# EAGLE design gain_mute (EAGLE 6.5.0)
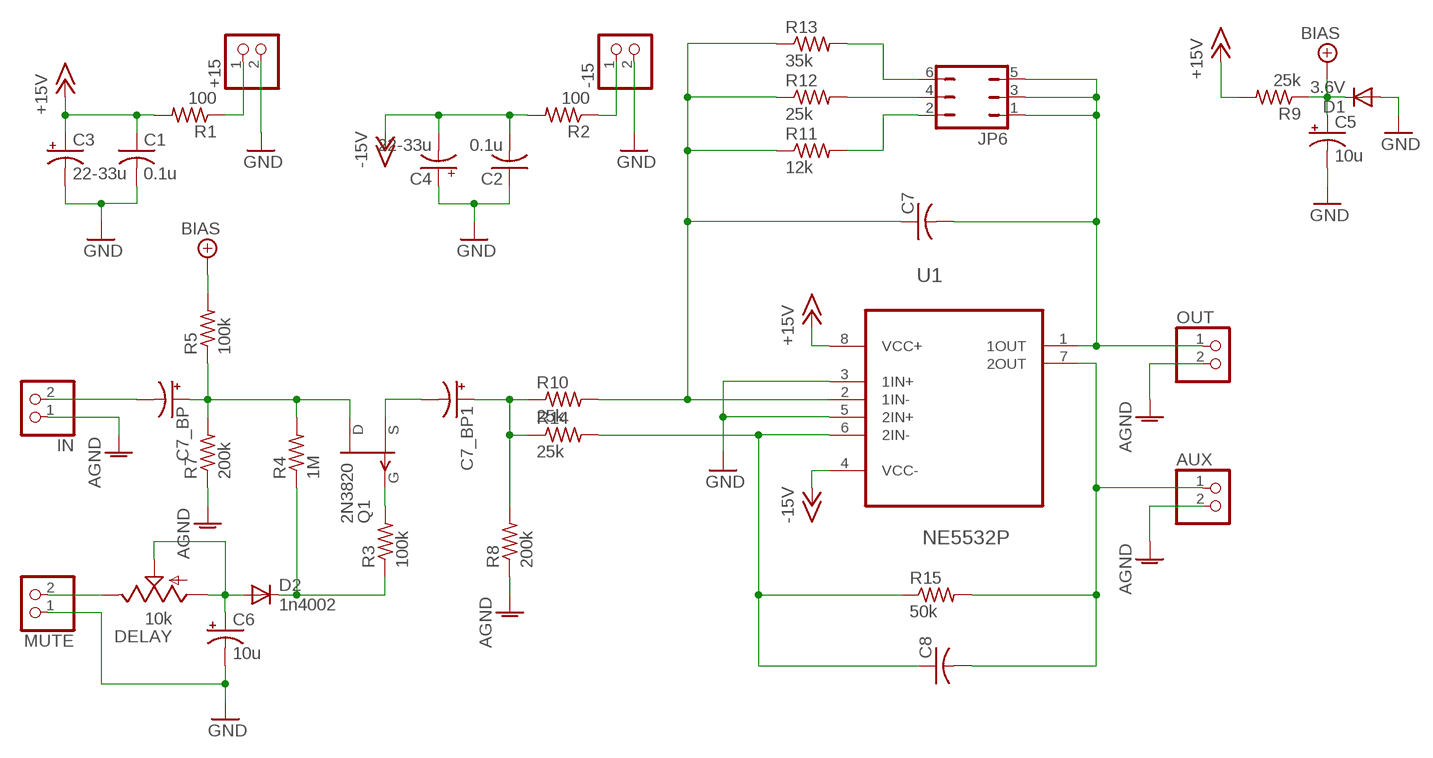
[diagram p0: schematic, sheet 1]

## Parts
+15  PINHD-1X2  [1X02]
-15  PINHD-1X2  [1X02]
AUX  PINHD-1X2  [1X02]
C1  0.1u  C-USC1206  [C1206]
C2  0.1u  C-USC1206  [C1206]
C3  22-33u  CPOL-USE2-5  [E2-5]
C4  22-33u  CPOL-USE2-5  [E2-5]
C5  10u  CPOL-USE2-5  [E2-5]
C6  10u  CPOL-USE2-5  [E2-5]
C7  C-US050-024X044  [C050-024X044]
C7_BP  CPOL-USE2.5-7  [E2,5-7]
C7_BP1  CPOL-USE2.5-7  [E2,5-7]
C8  C-US050-024X044  [C050-024X044]
D1  3.6V  DIODE-SOD123  [SOD123]
D2  1n4002  DIODE-SOD123  [SOD123]
DELAY  10k  TRIM_US-3223J  [3223J]
IN  PINHD-1X2  [1X02]
JP6  JP3Q  [JP3Q]
MUTE  PINHD-1X2  [1X02]
OUT  PINHD-1X2  [1X02]
Q1  2N3820  [TO92]
R1  100  R-US_0207/7  [0207/7]
R2  100  R-US_0207/7  [0207/7]
R3  100k  R-US_R1206  [R1206]
R4  1M  R-US_R1206  [R1206]
R5  100k  R-US_R1206  [R1206]
R7  200k  R-US_R1206  [R1206]
R8  200k  R-US_R1206  [R1206]
R9  25k  R-US_R1206  [R1206]
R10  25k  R-US_0207/7  [0207/7]
R11  12k  R-US_0207/7  [0207/7]
R12  25k  R-US_0207/7  [0207/7]
R13  35k  R-US_0207/7  [0207/7]
R14  25k  R-US_0207/7  [0207/7]
R15  50k  R-US_0207/7  [0207/7]
U1  NE5532P  [DIP254P762X508-8]

## Nets
+5V/2: C5.+ D1.C R5.2 R9.1 ; supply symbol labelled BIAS
+15V: C1.1 C3.+ R1.2 R9.2 U1.8(VCC+)
-15V: C2.2 C4.- R2.2 U1.4(VCC-)
AGND: AUX.2 IN.1 OUT.2 R7.1 R8.1
GND: +15.2 -15.2 C1.2 C2.1 C3.- C4.+ C5.- C6.- D1.A MUTE.1 U1.3(1IN+) U1.5(2IN+)
N$1: +15.1 R1.1
N$2: C7_BP.- IN.2
N$3: DELAY.3(E) MUTE.2
N$4: -15.1 R2.1
N$5: C7_BP.+ Q1.3(D) R4.2 R5.1 R7.2
N$6: C6.+ D2.A DELAY.1(A) DELAY.2(S)
N$7: D2.C R3.1 R4.1
N$8: Q1.2(G) R3.2
N$9: C7_BP1.- Q1.1(S)
N$10: C7_BP1.+ R8.2 R10.1 R14.1
N$11: C7.1 R10.2 R11.1 R12.1 R13.1 U1.2(1IN-)
N$12: JP6.4 R12.2
N$13: JP6.6 R13.2
N$14: JP6.2 R11.2
N$15: C7.2 JP6.1 JP6.3 JP6.5 OUT.1 U1.1(1OUT)
N$17: AUX.1 C8.2 R15.2 U1.7(2OUT)
N$18: C8.1 R14.2 R15.1 U1.6(2IN-)

## Library data of the parts
+15 -15 AUX IN MUTE OUT = pinhead:PINHD-1X2: PIN HEADER
C1 C2 C7 C8 = rcl:C-US: CAPACITOR, American symbol
C3-C6 C7_BP C7_BP1 = rcl:CPOL-US: POLARIZED CAPACITOR, American symbol
D1 D2 = diode:DIODE-: DIODE
DELAY = pot:TRIM_US-: POTENTIOMETER
JP6 = jumper:JP3Q: JUMPER
Q1 = transistor-fet:2N3820: P-Channel Junction FET Source: http://www.fairchildsemi.com/ds/2N/2N3820.pdf
R1-R5 R7-R15 = rcl:R-US_: RESISTOR, American symbol
U1 = ne5532:NE5532P: OPERATIONAL AMPLIFIERS; MPN: NE5532P; OC_FARNELL: 1106092; OC_NEWARK: 59K8751; PACKAGE: PDIP; SUPPLIER: Texas Instruments

## Board
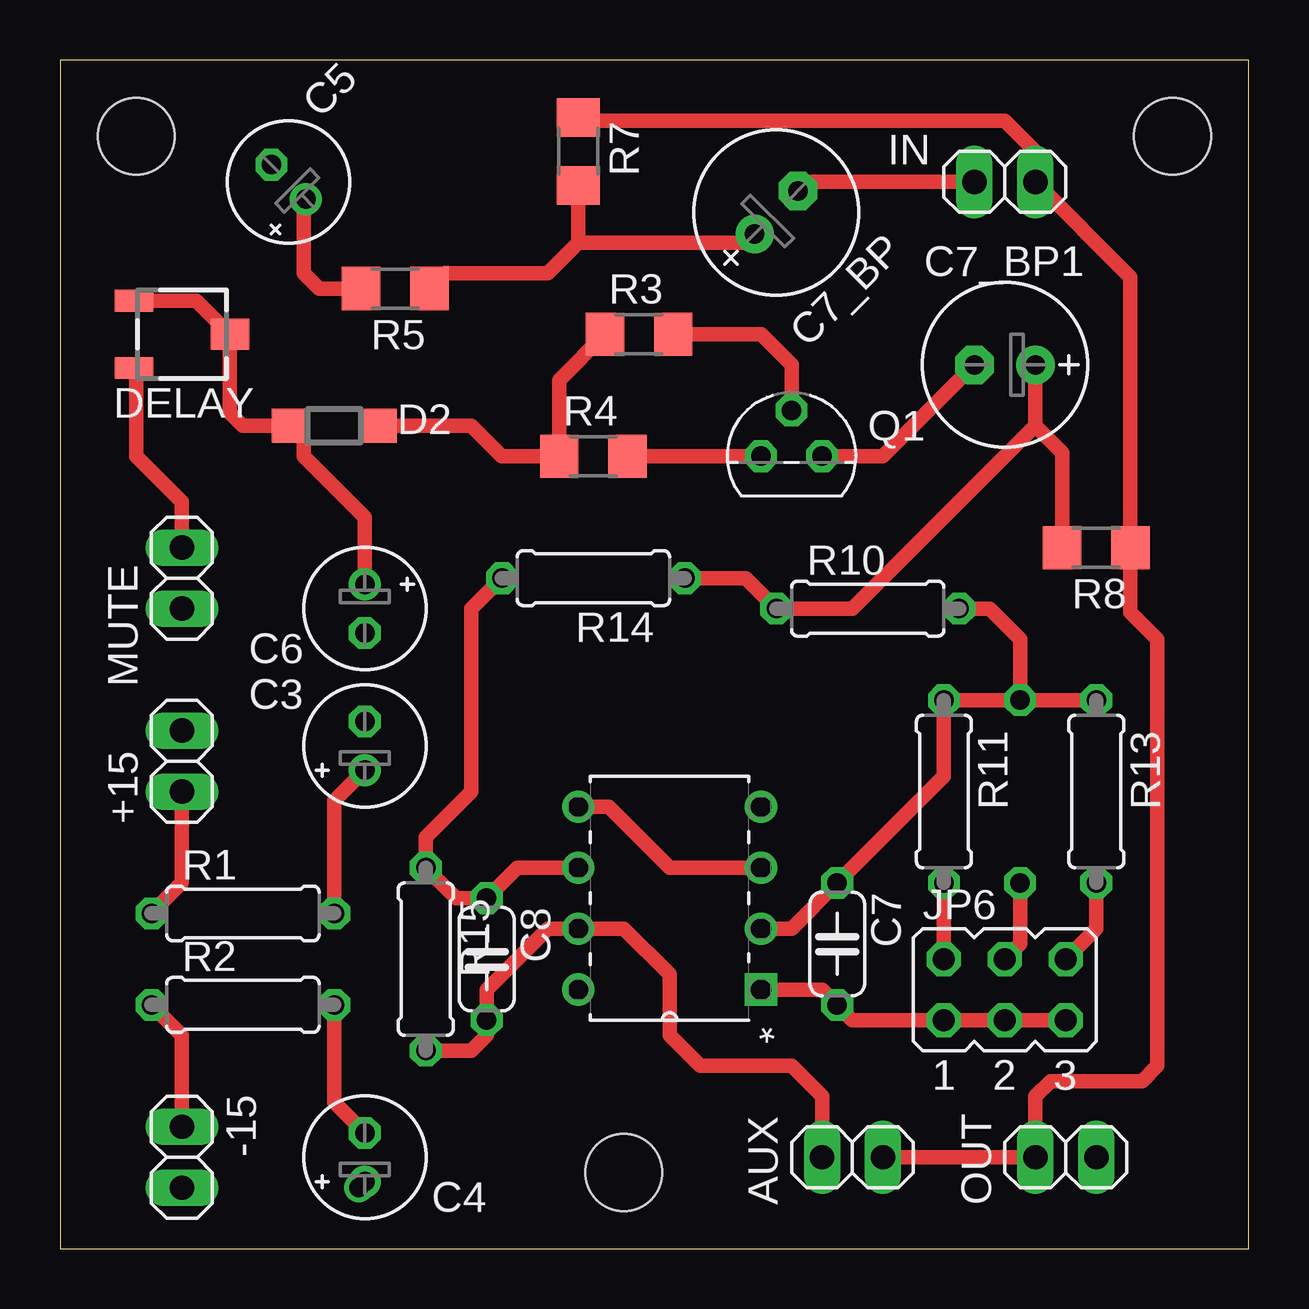
[diagram p1: board, top side]
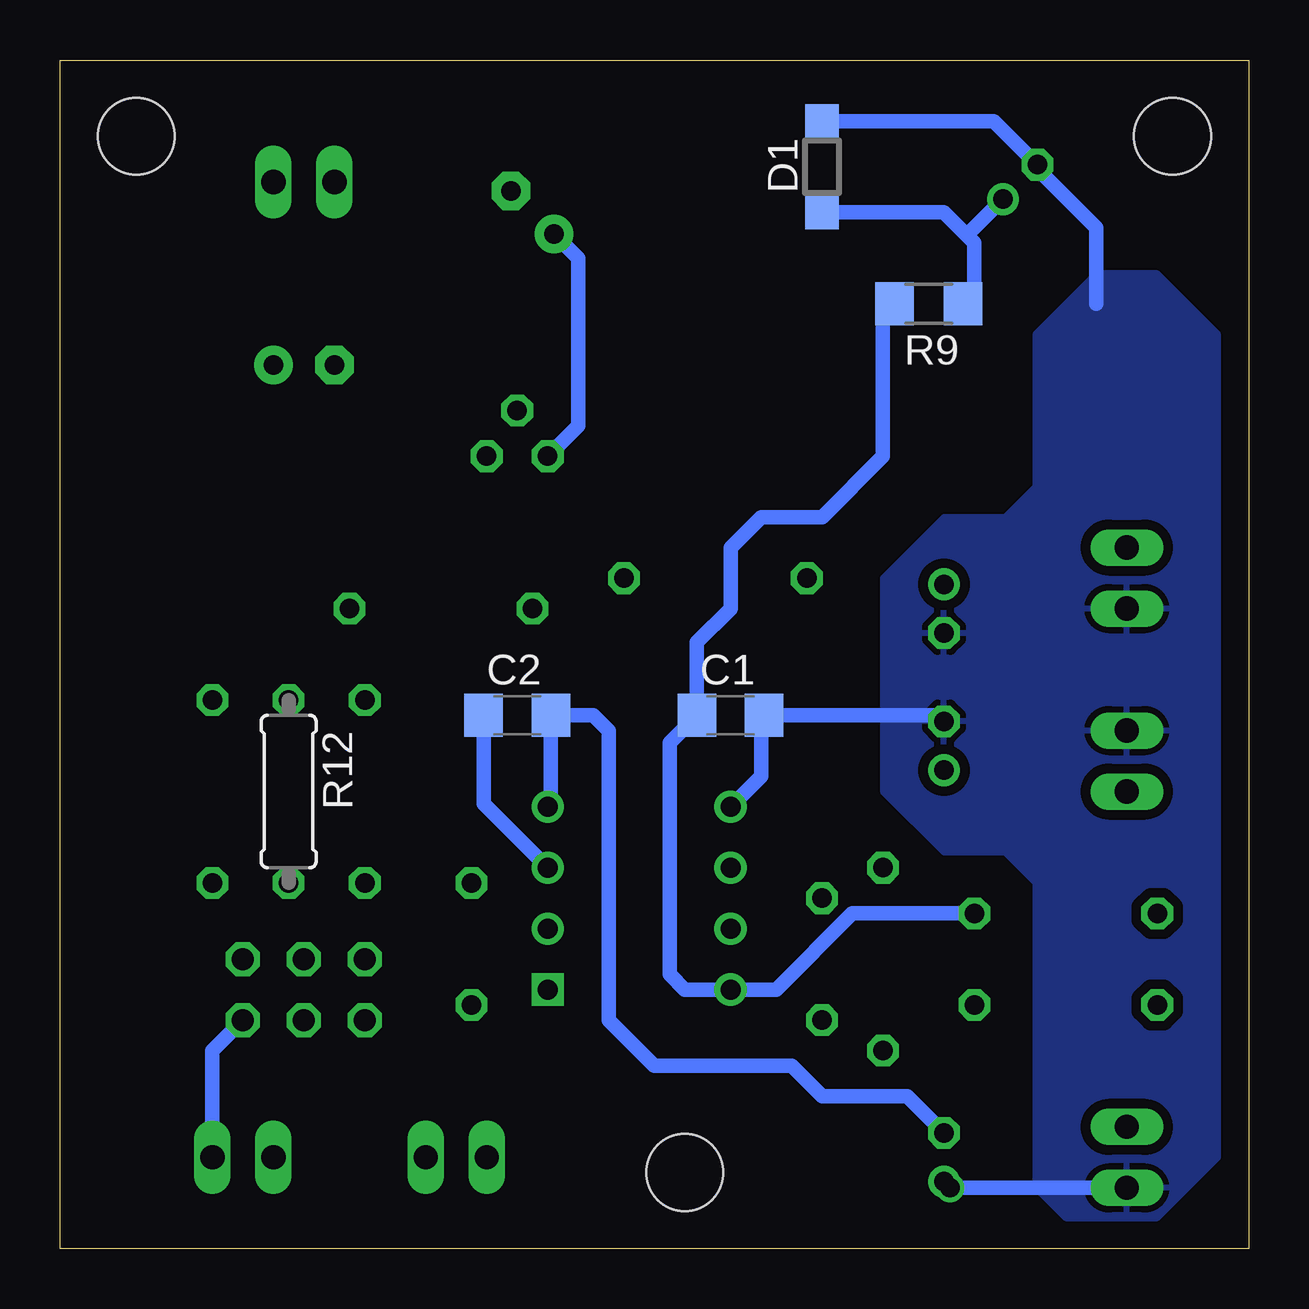
[diagram p2: board, bottom side, seen from below]

Size 49.53 x 49.53 mm. Coordinates in mm from the lower left corner, seen from the top.
Outline: 0,0 49.53,0 49.53,49.53 0,49.53 0,0
Copper layers (1*16): Top 0.035mm / dielectric 1.5mm / Bottom 0.035mm
Design rules "default": minimum track width 10mil, minimum drill 24mil, track to track 8mil, track to pad 8mil, pad to pad 8mil, via to via 8mil, smd to smd 8mil, copper to edge 40mil, drill to drill 8mil, minimum pad ring 10mil, minimum via ring 8mil, stop-mask expansion 4mil, vias tented up to drill 0mil, thermal gap 10mil
Holes 3.2 mm at 23.5,3.17 3.17,46.35 46.35,46.35

### Footprints (pad centres in the part's own frame; a part is rotated, then mirrored left to right if it is on the bottom)
1X02 = drill 1.016 long: 1 -1.27,0; 2 1.27,0
C1206 = smd 1.6 x 1.8: 1 -1.4,0; 2 1.4,0
E2-5 = drill 0.813 pad 1.27: + -1.016,0 | drill 0.813 pad 1.27 octagon: - 1.016,0
C050-024X044 = drill 0.813 octagon: 1 -2.54,0; 2 2.54,0
E2,5-7 = drill 0.813 pad 1.6: + -1.27,0 | drill 0.813 pad 1.6 octagon: - 1.27,0
SOD123 = smd 1.4 x 1.4: A 1.9,0; C -1.9,0
3223J = smd 1.6 x 0.9: 1 -2,1.4; 3 -2,-1.4 | smd 1.6 x 1.3: 2 2,0
JP3Q = drill 0.914 octagon: 1 -2.54,-1.27; 2 -2.54,1.27; 3 0,-1.27; 4 0,1.27; 5 2.54,-1.27; 6 2.54,1.27
TO92 = drill 0.813 octagon: 1 1.27,0; 2 0,1.905; 3 -1.27,0
0207/7 = drill 0.813 octagon: 1 -3.81,0; 2 3.81,0
R1206 = smd 1.6 x 1.803: 1 -1.422,0; 2 1.422,0
DIP254P762X508-8 = drill 0.838 square: 1 -7.62,7.62 | drill 0.838: 2 -7.62,5.08; 3 -7.62,2.54; 4 -7.62,0; 5 0,0; 6 0,2.54; 7 0,5.08; 8 0,7.62

### Placement (x,y rotation side)
+15  5.08,20.32 90 top
-15  5.08,3.81 270 top
AUX  33.02,3.81 0 top
C1  21.59,22.23 0 bottom
C2  30.48,22.23 0 bottom
C3  12.7,20.95 90 top
C4  12.7,3.81 90 top
C5  9.53,44.45 135 top
C6  12.7,26.67 270 top
C7  32.38,12.7 270 top
C7_BP  29.84,43.18 45 top
C7_BP1  39.37,36.83 180 top
C8  17.78,12.06 270 top
D1  17.78,45.09 90 bottom
D2  11.43,34.29 180 top
DELAY  5.08,38.1 0 top
IN  39.37,44.45 180 top
JP6  39.37,10.79 0 top
MUTE  5.08,27.94 90 top
OUT  41.91,3.81 180 top
Q1  30.48,33.02 0 top
R1  7.62,13.97 0 top
R2  7.62,10.16 0 top
R3  24.13,38.1 0 top
R4  22.23,33.02 0 top
R5  13.97,40.01 180 top
R7  21.59,45.72 270 top
R8  43.18,29.21 180 top
R9  13.34,39.37 180 bottom
R10  33.66,26.67 0 top
R11  36.83,19.05 270 top
R12  40.01,19.05 270 bottom
R13  43.18,19.05 270 top
R14  22.23,27.94 180 top
R15  15.24,12.06 270 top
U1  21.59,18.41 180 top

### Tracks (layer width: path | path; a pad name or v marks a point on that pad's centre or on a via)
+5V/2
  Top 0.61: R5.2 10.79,40.01 10.16,40.64 10.16,43.65 C5.+
  Bottom 0.61: D1.C 12.71,43.19 11.75,42.23 | 11.75,42.23 11.43,41.91 11.43,39.85 R9.1 | C5.+ | C5.+ 11.75,42.23
+15V
  Top 0.61: R1.2 11.43,18.67 C3.+
  Bottom 0.61: R1.2 16.51,13.97 19.68,10.79 U1.8 23.5,10.79 24.13,11.43 24.13,21.09 C1.1 22.99,25.27 21.59,26.67 21.59,29.21 20.32,30.48 17.78,30.48 15.24,33.02 15.24,38.89 R9.2
-15V
  Top 0.61: R2.2 11.43,6.1 C4.-
  Bottom 0.61: C4.- 14.22,6.35 17.78,6.35 19.05,7.62 24.77,7.62 26.67,9.53 26.67,21.59 27.3,22.23 C2.2 29.08,18.55 U1.4
AGND
  Top 0.61: R7.1 21.59,46.99 39.37,46.99 40.64,45.72 IN.1 44.6,40.49 R8.1 44.6,26.52 45.72,25.4 45.72,7.62 45.09,6.99 41.27,6.99 40.64,6.35 OUT.2 AUX.2
GND  (via drill 0.8 pad 0.81)
  Top 0.61: v12.45,2.54 C4.+ | U1.5 22.86,18.41 25.4,15.88 U1.3
  Bottom 0.61: -15.2 v12.45,2.54 | U1.5 20.32,19.68 20.32,22.09 C1.2 12.95,22.23 C3.- | C2.1 31.88,18.55 U1.3 | D1.A 10.62,46.98 C5.- 8.81,45 6.35,42.55 6.35,39.37
  pour Bottom (isolate 0.406): 7.62,1.27 3.81,1.27 1.27,3.81 1.27,38.1 3.81,40.64 6.35,40.64 8.89,38.1 8.89,31.75 10.16,30.48 12.7,30.48 15.24,27.94 15.24,19.05 12.7,16.51 10.16,16.51 8.89,15.24 8.89,2.54
N$1
  Top 0.61: +15.1 5.08,15.24 R1.1
N$2
  Top 0.61: IN.2 31.11,44.45 C7_BP.-
N$3
  Top 0.61: MUTE.2 5.08,31.11 3.17,33.02 3.17,36.6 DELAY.3
N$4
  Top 0.61: -15.1 5.08,8.89 R2.1
N$5
  Top 0.61: R4.2 Q1.3 | R7.2 21.59,41.91 | 21.59,41.91 20.32,40.64 16.03,40.64 R5.1 | 21.59,41.91 28.57,41.91 C7_BP.+
  Bottom 0.61: Q1.3 27.94,34.29 27.94,41.27 C7_BP.+
N$6
  Top 0.61: DELAY.1 5.68,39.5 DELAY.2 7.08,34.83 7.62,34.29 D2.A 10.16,33.66 10.16,33.02 12.7,30.48 C6.+
N$7
  Top 0.61: D2.C 17.14,34.29 18.41,33.02 R4.1 20.8,36.2 R3.1
N$8
  Top 0.61: R3.2 29.21,38.1 30.48,36.83 Q1.2
N$9
  Top 0.61: Q1.1 34.29,33.02 C7_BP1.-
N$10
  Top 0.61: 41.91,29.21 R8.2 41.76,33.17 40.64,34.29 | R14.1 28.57,27.94 R10.1 33.02,26.67 40.64,34.29 | C7_BP1.+ 40.64,34.29
N$11
  Top 0.61: R13.1 R12.1 | R12.1 R11.1 36.83,19.68 C7.1 30.48,13.34 U1.2 | R10.2 38.73,26.67 40.01,25.4 R12.1
N$12
  Top 0.61: R12.2 40.01,12.7 JP6.4
N$13
  Top 0.61: R13.2 43.18,13.34 JP6.6
N$14
  Top 0.61: R11.2 JP6.2
N$15
  Top 0.61: JP6.5 JP6.3 JP6.1 33.02,9.53 C7.2 31.75,10.79 U1.1
  Bottom 0.61: OUT.1 43.18,8.26 JP6.5
N$17
  Top 0.61: AUX.1 31.75,6.35 30.48,7.62 26.67,7.62 25.4,8.89 25.4,11.43 23.5,13.34 U1.7 20.32,13.34 17.78,10.79 C8.2 17.78,8.89 17.14,8.26 R15.2
N$18
  Top 0.61: R14.2 17.14,26.67 17.14,19.05 15.24,17.14 R15.1 16.51,14.61 C8.1 19.05,15.88 U1.6